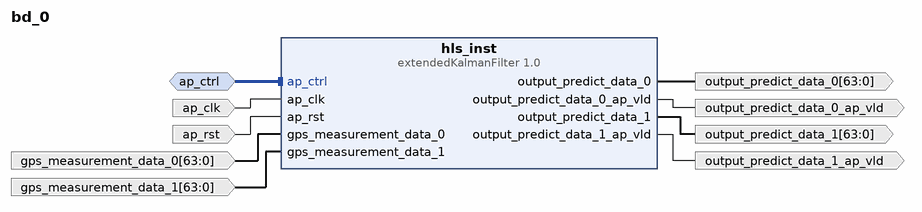
[diagram p0: block diagram of the top level]
# Vivado block design bd_0, xc7k160tfbg676-2, Vivado 2023.2
create_bd_design bd_0

create_bd_intf_port -mode Slave -vlnv xilinx.com:interface:acc_handshake_rtl:1.0 ap_ctrl
create_bd_port -dir I -type clk ap_clk
set_property -dict {CONFIG.FREQ_HZ 250000000.0} [get_bd_ports ap_clk]
create_bd_port -dir I -type rst ap_rst
set_property -dict {CONFIG.POLARITY ACTIVE_HIGH} [get_bd_ports ap_rst]
create_bd_port -dir I -from 63 -to 0 -type data gps_measurement_data_0
create_bd_port -dir I -from 63 -to 0 -type data gps_measurement_data_1
create_bd_port -dir O -from 63 -to 0 -type data output_predict_data_0
create_bd_port -dir O output_predict_data_0_ap_vld
create_bd_port -dir O -from 63 -to 0 -type data output_predict_data_1
create_bd_port -dir O output_predict_data_1_ap_vld

create_bd_cell -type ip -vlnv xilinx.com:hls:extendedKalmanFilter:1.0 hls_inst

# ---- connections ----

connect_bd_intf_net -intf_net ap_ctrl_0_1 [get_bd_intf_ports ap_ctrl] [get_bd_intf_pins hls_inst/ap_ctrl]
connect_bd_net -net ap_clk_0_1 [get_bd_ports ap_clk] [get_bd_pins hls_inst/ap_clk]
connect_bd_net -net ap_rst_0_1 [get_bd_ports ap_rst] [get_bd_pins hls_inst/ap_rst]
connect_bd_net -net gps_measurement_data_0_0_1 [get_bd_ports gps_measurement_data_0] [get_bd_pins hls_inst/gps_measurement_data_0]
connect_bd_net -net gps_measurement_data_1_0_1 [get_bd_ports gps_measurement_data_1] [get_bd_pins hls_inst/gps_measurement_data_1]
connect_bd_net [get_bd_pins hls_inst/output_predict_data_0] [get_bd_ports output_predict_data_0]
connect_bd_net [get_bd_pins hls_inst/output_predict_data_0_ap_vld] [get_bd_ports output_predict_data_0_ap_vld]
connect_bd_net [get_bd_pins hls_inst/output_predict_data_1] [get_bd_ports output_predict_data_1]
connect_bd_net [get_bd_pins hls_inst/output_predict_data_1_ap_vld] [get_bd_ports output_predict_data_1_ap_vld]

validate_bd_design
save_bd_design
